# Altium schematic sheet ControlStage.SchDoc
size A
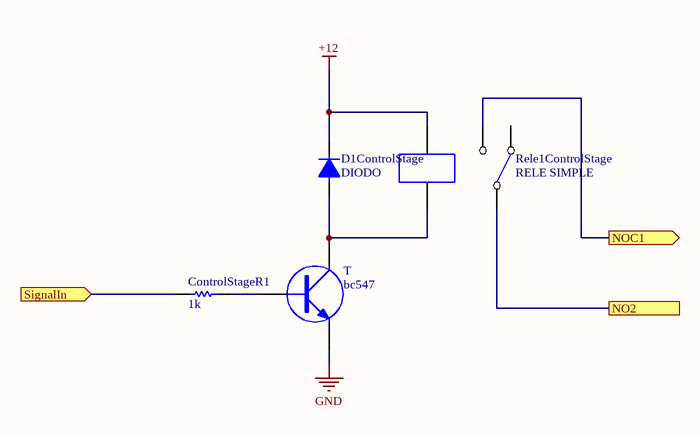
[diagram p0: ControlStage.SchDoc]

## Parts
ControlStageR1  1k  [RES400]
D1ControlStage  DIODO  [DO41]
Rele1ControlStage  RELE SIMPLE  [RELE SERIE 964]
T  bc547  [TO-220 H - DISIPADOR]

## Ports
NO2, NOC1 (out), SignalIn (in)

## Nets
+12: D1ControlStage.2 Rele1ControlStage.B1
GND: T.3(E)
NO2: Rele1ControlStage.C1 ; port NO2
NOC1: Rele1ControlStage.NA1 ; port NOC1
SignalIn: ControlStageR1.1 ; port SignalIn
NetControlStageR1_2: ControlStageR1.2 T.1(B)
NetD1ControlStage_1: D1ControlStage.1 Rele1ControlStage.B2 T.2(C)

Not connected (* = marked no-connect by the designer): Rele1ControlStage NC1

## Library data of the parts
ControlStageR1 = RES
T = TRANSISTOR NPN